# EAGLE schematic Fortuna (EAGLE 8.0.0)
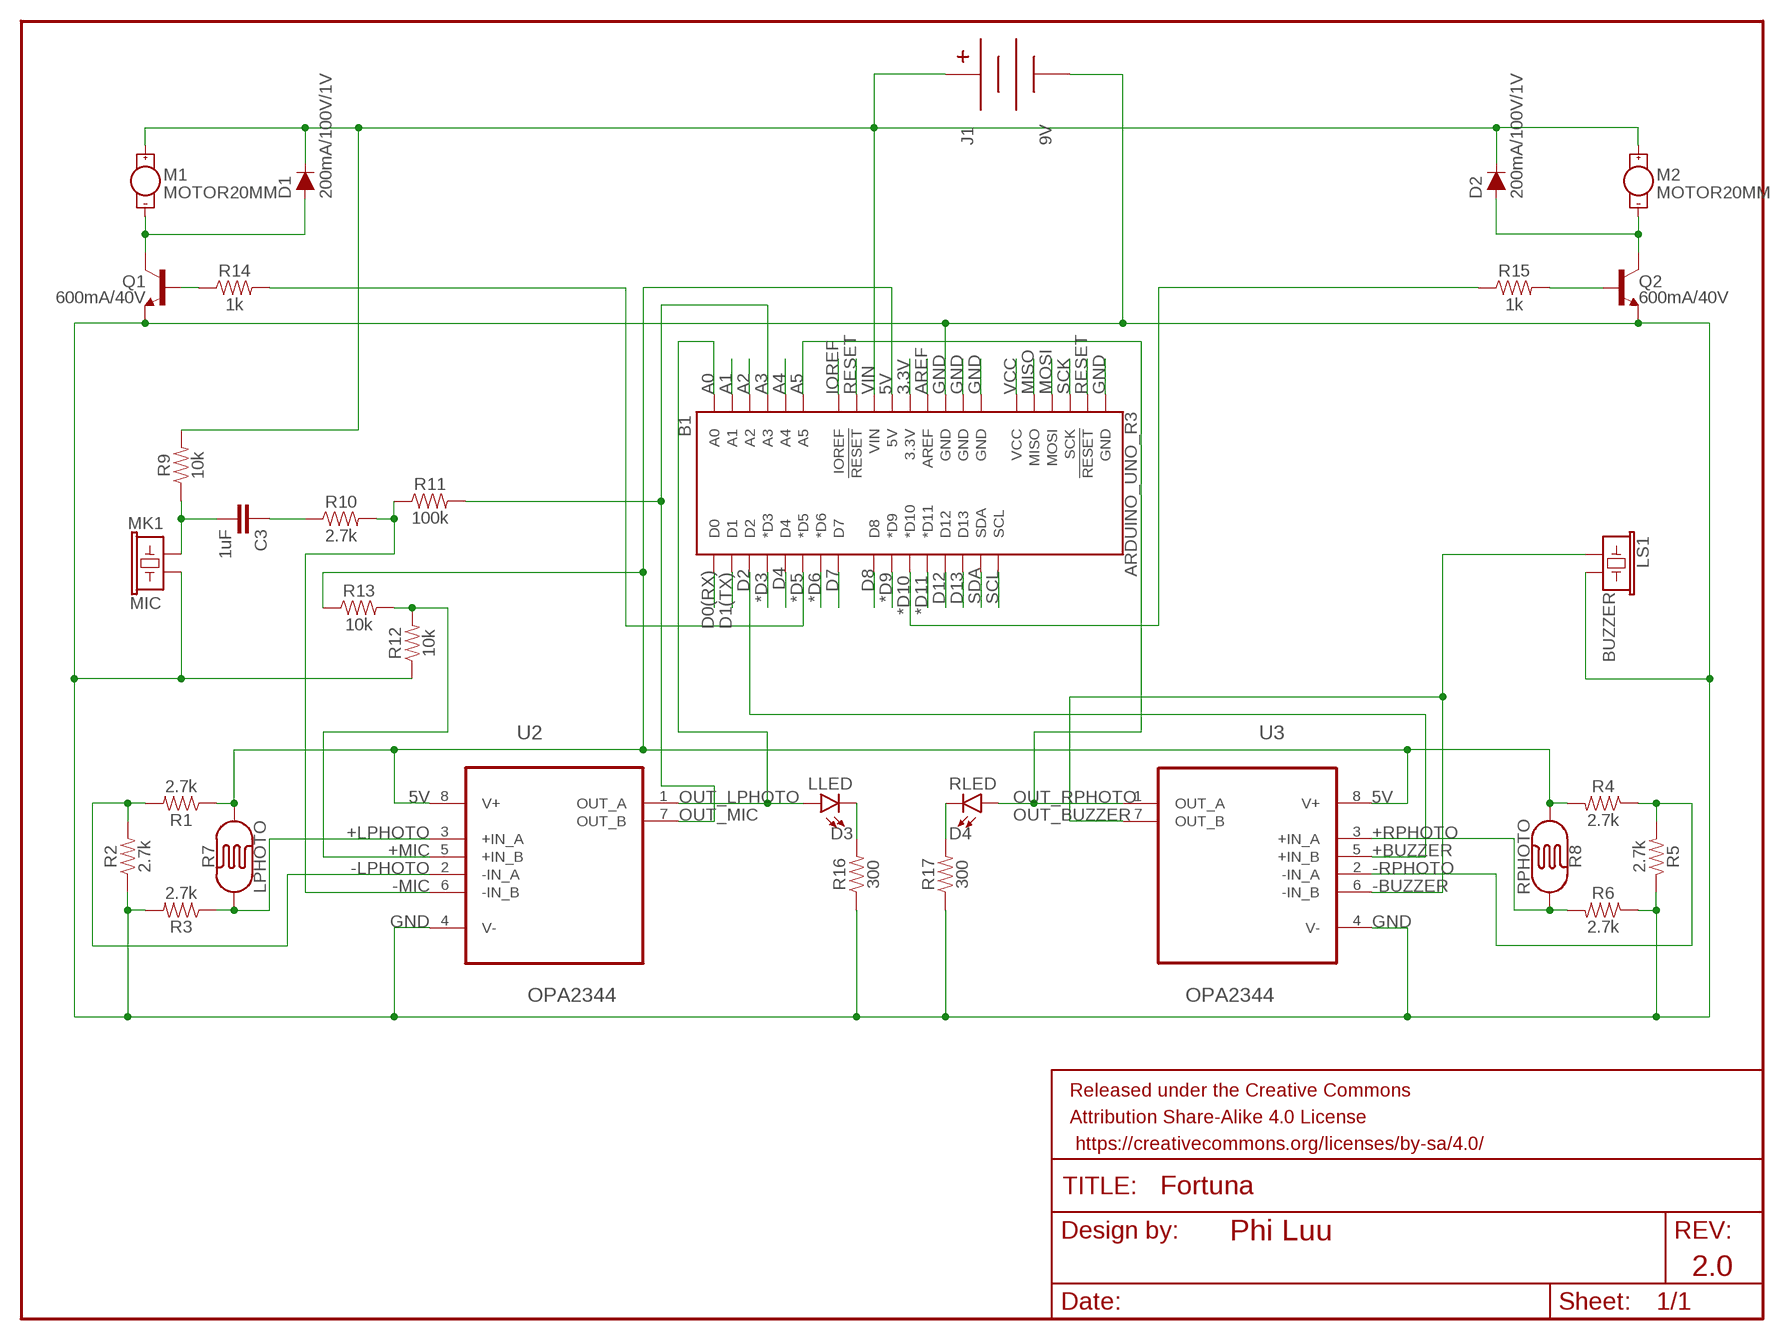
[diagram p0: schematic, sheet 1]

## Parts
B1  ARDUINO_UNO_R3  [ARDUINO_R3]
C3  1uF  0.1UF-KIT-EZ-50V-20%  [CAP-PTH-SMALL-KIT]
D1  200mA/100V/1V  DIODE-1N4148  [DIODE-1N4148]
D2  200mA/100V/1V  DIODE-1N4148  [DIODE-1N4148]
D3  LLED  LED3MM  [LED_3MM]
D4  RLED  LED3MM  [LED_3MM]
FRAME1  FRAME-LETTER  [CREATIVE_COMMONS]
J1  9V  BC9VPC  [BC9VPC]
LS1  BUZZER  BUZZER-PTH  [BUZZER-12MM]
M1  MOTOR20MM  MOTOR10MM  [VIBE-MOTOR-10MM]
M2  MOTOR20MM  MOTOR10MM  [VIBE-MOTOR-10MM]
MK1  MIC  MIC-PTH  [MICROPHONE-PTH-9.7MM]
Q1  600mA/40V  TRANS_NPN-P2N2222A  [TO-92]
Q2  600mA/40V  TRANS_NPN-P2N2222A  [TO-92]
R1  2.7k  1KOHM-HORIZ-1/4W-5%  [AXIAL-0.3]
R2  2.7k  1KOHM-HORIZ-1/4W-5%  [AXIAL-0.3]
R3  2.7k  1KOHM-HORIZ-1/4W-5%  [AXIAL-0.3]
R4  2.7k  1KOHM-HORIZ-1/4W-5%  [AXIAL-0.3]
R5  2.7k  1KOHM-HORIZ-1/4W-5%  [AXIAL-0.3]
R6  2.7k  1KOHM-HORIZ-1/4W-5%  [AXIAL-0.3]
R7  LPHOTO  PHOTOCELLPTH  [PHOTOCELL]
R8  RPHOTO  PHOTOCELLPTH  [PHOTOCELL]
R9  10k  1KOHM-HORIZ-1/4W-5%  [AXIAL-0.3]
R10  2.7k  1KOHM-HORIZ-1/4W-5%  [AXIAL-0.3]
R11  100k  1KOHM-HORIZ-1/4W-5%  [AXIAL-0.3]
R12  10k  1KOHM-HORIZ-1/4W-5%  [AXIAL-0.3]
R13  10k  1KOHM-HORIZ-1/4W-5%  [AXIAL-0.3]
R14  1k  1KOHM-HORIZ-1/4W-5%  [AXIAL-0.3]
R15  1k  1KOHM-HORIZ-1/4W-5%  [AXIAL-0.3]
R16  300  1KOHM-HORIZ-1/4W-5%  [AXIAL-0.3]
R17  300  1KOHM-HORIZ-1/4W-5%  [AXIAL-0.3]
U2  OPA2344  OPA2343UA  [SOIC127P600X175-8N]
U3  OPA2344  OPA2343UA  [SOIC127P600X175-8N]

## Nets
3.3V: B1.3.3V
5V: B1.5V R1.P$1 R4.P$2 R7.2 R8.2 R13.P$1 U2.8(V+) U3.8(V+)
*D3: B1.D3(*D3)
*D5: B1.D5(*D5) R14.P$2
*D6: B1.D6(*D6)
*D9: B1.D9(*D9)
*D10: B1.D10(*D10) R15.P$1
*D11: B1.D11(*D11)
+LPHOTO: R3.P$1 R7.1 U2.3(+IN_A)
+MIC: R12.P$2 R13.P$2 U2.5(+IN_B)
+RPHOTO: R6.P$2 R8.1 U3.3(+IN_A)
-LPHOTO: R1.P$2 R2.P$2 U2.2(-IN_A)
-MIC: R10.P$2 R11.P$1 U2.6(-IN_B)
-RPHOTO: R4.P$1 R5.P$2 U3.2(-IN_A)
A0: B1.A0 D3.A U2.1(OUT_A)
A1: B1.A1
A2: B1.A2
A3: B1.A3 R11.P$2 U2.7(OUT_B)
A4: B1.A4
A5: B1.A5 D4.A U3.1(OUT_A)
AREF: B1.AREF
D0(RX): B1.D0
D1(TX): B1.D1
D2: B1.D2 U3.5(+IN_B)
D4: B1.D4
D7: B1.D7
D8: B1.D8
D12: B1.D12
D13: B1.D13
GND: B1.GND@1(GND) B1.GND@2(GND) B1.GND@3(GND) B1.GND@4(GND) J1.V- LS1.- MK1.GND Q1.3(E) Q2.3(E) R2.P$1 R3.P$2 R5.P$1 R6.P$1 R12.P$1 R16.P$1 R17.P$1 U2.4(V-) U3.4(V-)
IOREF: B1.IOREF
MISO: B1.MISO
MOSI: B1.MOSI
N$1: C3.2 MK1.OUT R9.P$1
N$2: C3.1 R10.P$1
N$9: Q1.2(B) R14.P$1
N$10: D1.A M1.- Q1.1(C)
N$12: D2.A M2.- Q2.1(C)
N$14: Q2.2(B) R15.P$2
N$15: D3.K(C) R16.P$2
N$18: D4.K(C) R17.P$2
OUT_BUZZER: LS1.+ U3.6(-IN_B) U3.7(OUT_B)
RESET: B1.RESET@1(!RESET!) B1.RESET@2(!RESET!)
SCK: B1.SCK
SCL: B1.SCL
SDA: B1.SDA
VCC: B1.VCC
VIN: B1.VIN D1.C D2.C J1.V+ M1.+ M2.+ R9.P$2

## Notes on the sheet
- OUT_LPHOTO | OUT_RPHOTO
- OUT_MIC
- +BUZZER
- -BUZZER
- Phi Luu
- 2.0

## Library data of the parts
B1 = SparkFun-Boards:ARDUINO_UNO_R3: Arduino R3 Footprint with SPI header Arduino Uno R3 Compatible Footprint. Matches PCB size of the original board. SparkFun Products: SAMD21 Dev Breakout <https://www.sparkfun.com/products/13672> RedBoard <https://www.sparkfun.com/products/12757> R3 Stackable Headers <https://www.sparkfun.com/products/11417>
C3 = SparkFun-Capacitors:0.1UF: 0.1µF ceramic capacitors A capacitor is a passive two-terminal electrical component used to store electrical energy temporarily in an electric field.; PROD_ID: CAP-08370; VALUE: 0.1uF
D1 D2 = SparkFun-DiscreteSemi:DIODE: Diode These are standard reverse protection diodes and small signal diodes. SparkFun Products: SparkFun SparkPunk Sound Kit <https://www.sparkfun.com/products/11177> SparkFun ESP8266 Thing <https://www.sparkfun.com/products/13231>; PROD_ID: DIO-08378
D3 D4 = SparkFun-LED:LED: LED (Generic) Standard schematic elements and footprints for 5mm, 3mm, 1206, and 0603 sized LEDs. Generic LEDs with no color specified.; PROD_ID: DIO-08794
FRAME1 = SparkFun-Aesthetics:FRAME-LETTER: Schematic Frame - Letter Standard 8.5x11 US Letter frame
J1 = SparkFun-Connectors:BC9VPC: 9V Battery Holder - PC Mount Standard and Kit footprints included SparkFun Products: SparkFun SparkPunk Sound Kit <https://www.sparkfun.com/products/11177> SparkFun SparkPunk Sequencer Kit <https://www.sparkfun.com/products/12707>; PROD_ID: BATT-10855
LS1 = SparkFun-Electromechanical:BUZZER: Buzzer Small round buzzers that operate around the audible 2kHz range. You can use these as speakers to create simple music or user interfaces. Variant Overview: PTH - Mini Speaker - PC Mount 12mm 2.048kHz <https://www.sparkfun.com/products/7950> PTH_KIT - Mini Speaker - PC Mount 12mm 2.048kHz <https://www.sparkfun.com/products/7950> KIT simplifies soldering by adding stop mask to one side of the pads. PTH_NO_SILK - Mini Speaker - PC Mount 12mm 2.048kHz <https://www.sparkfun.com/products/7950> No silkscreen indicator of buzzer outline. PTH_KIT_NO_SILK - Mini Speaker - PC Mount 12mm 2.048kHz <https://www.sparkfun.com/products/7950> KIT package w/o silkscreen SMD - Buzzer Audio Magnetic (CCV-084B16) SMD buzzer used on, e.g. the LilyPad Buzzer <https://www.sparkfun.com/products/8463> and RFID USB Reader <https://www.sparkfun.com/products/9963>. SMD_KIT - Buzzer Audio Magnetic (CCV-084B16) SMD Buzzer with elongated pins to make soldering easier. Used on the SparkFun Simon Says - Surface Mount Soldering Kit <https://www.sparkfun.com/products/10935>.; PROD_ID: COMP-08253; SF_SKU: COM-07950
M1 M2 = SparkFun-Electromechanical:MOTOR: Motor (Single-Phase) Two-terminal, single-phase motors. SparkFun Products Vibration Motor <https://www.sparkfun.com/products/8449> (ROB-08449) Physical dimension and wire connections for this powerful vibration motor. Motor has a self adhesive backing.; PROD_ID: COMP-08572; SF_SKU: ROB-08449
MK1 = SparkFun-Sensors:MIC: Microphone Omni-directional electret microphones - one through-hole, the other SMD. Datasheet <http://cdn.sparkfun.com/datasheets/Sensors/Sound/CEM-C9745JAD462P2.54R.pdf> (through-hole mic) Datasheet <http://www.challengeelectronics.com/downloads/microphones/omni_directional/CEM-OB6018-3EAD443C43MR.pdf> (SMD mic) SparkFun Products PTH Electret Microphone <https://www.sparkfun.com/products/8635> (COM-08635) SparkFun Electret Microphone Breakout <https://www.sparkfun.com/products/9964> (BOB-09964) Digital Sandbox <https://www.sparkfun.com/products/12651> (DEV-12651) SparkFun Sound Detector <https://www.sparkfun.com/products/12642> (SEN-12642) SMD Microphone SparkFun Voice Recorder Breakout - ISD1932 <https://www.sparkfun.com/products/retired/10653> (BOB-10653); PROD_ID: COMP-08856; SF_ID: COM-08635
Q1 Q2 = SparkFun-DiscreteSemi:TRANS_NPN: NPN transistor Current controlled devices typically used to amplify current or used as a switch. BC547 - COM-08928 <http://www.sparkfun.com/products/8928> (TO-92 45V 100mA) (1.Collector 2.Base 3.Emitter) 2N3904 - COM-00521 <http://www.sparkfun.com/products/521> (TO-92 40V 200mA) (1.Emitter 2.Base 3.Collector) P2N2222A - COM-12852 <http://www.sparkfun.com/products/12852> (TO-92 40V 600mA) (1.Collector 2.Base 3.Emitter); PROD_ID: TRANS-09536
R1-R6 R9-R13 R16 R17 = SparkFun-Resistors:1KOHM: 1kΩ resistor A resistor is a passive two-terminal electrical component that implements electrical resistance as a circuit element. Resistors act to reduce current flow, and, at the same time, act to lower voltage levels within circuits. - Wikipedia; PROD_ID: RES-08380; VALUE: 1k
R7 R8 = SparkFun-Sensors:PHOTOCELL: Photocell (Photodetector, Photo Resistor, CdS) This is a very small light sensor. A photocell changes (also called a photodetector, photo resistor, CdS or photoconductive cell) resistance depending on the amount of light it is exposed to. These little sensors make great ambient light triggers (when light in the room turns on, do something). Datasheet <http://cdn.sparkfun.com/datasheets/Sensors/LightImaging/SEN-09088.pdf> SparkFun Products Mini Photocell <https://www.sparkfun.com/products/9088> (SEN-09088); PROD_ID: COMP-09129; SF_ID: SEN-09088
R14 R15 = SparkFun-Resistors:1KOHM: 1kΩ resistor A resistor is a passive two-terminal electrical component that implements electrical resistance as a circuit element. Resistors act to reduce current flow, and, at the same time, act to lower voltage levels within circuits. - Wikipedia; PROD_ID: RES-08380
U2 U3 = Texas Instruments_By_element14_Batch_1:OPA2343UA: SINGLE-SUPPLY, RAIL-TO-RAIL OPERATIONAL AMPLIFIERS microAmplifier ? Series; MPN: OPA2343UA; OC_FARNELL: -; OC_NEWARK: 96K4526; PACKAGE: SOIC-8; SUPPLIER: Texas Instruments